# Altium schematic sheet Controller.SchDoc
size A4; SheetNumber: 2; SheetTotal: 2
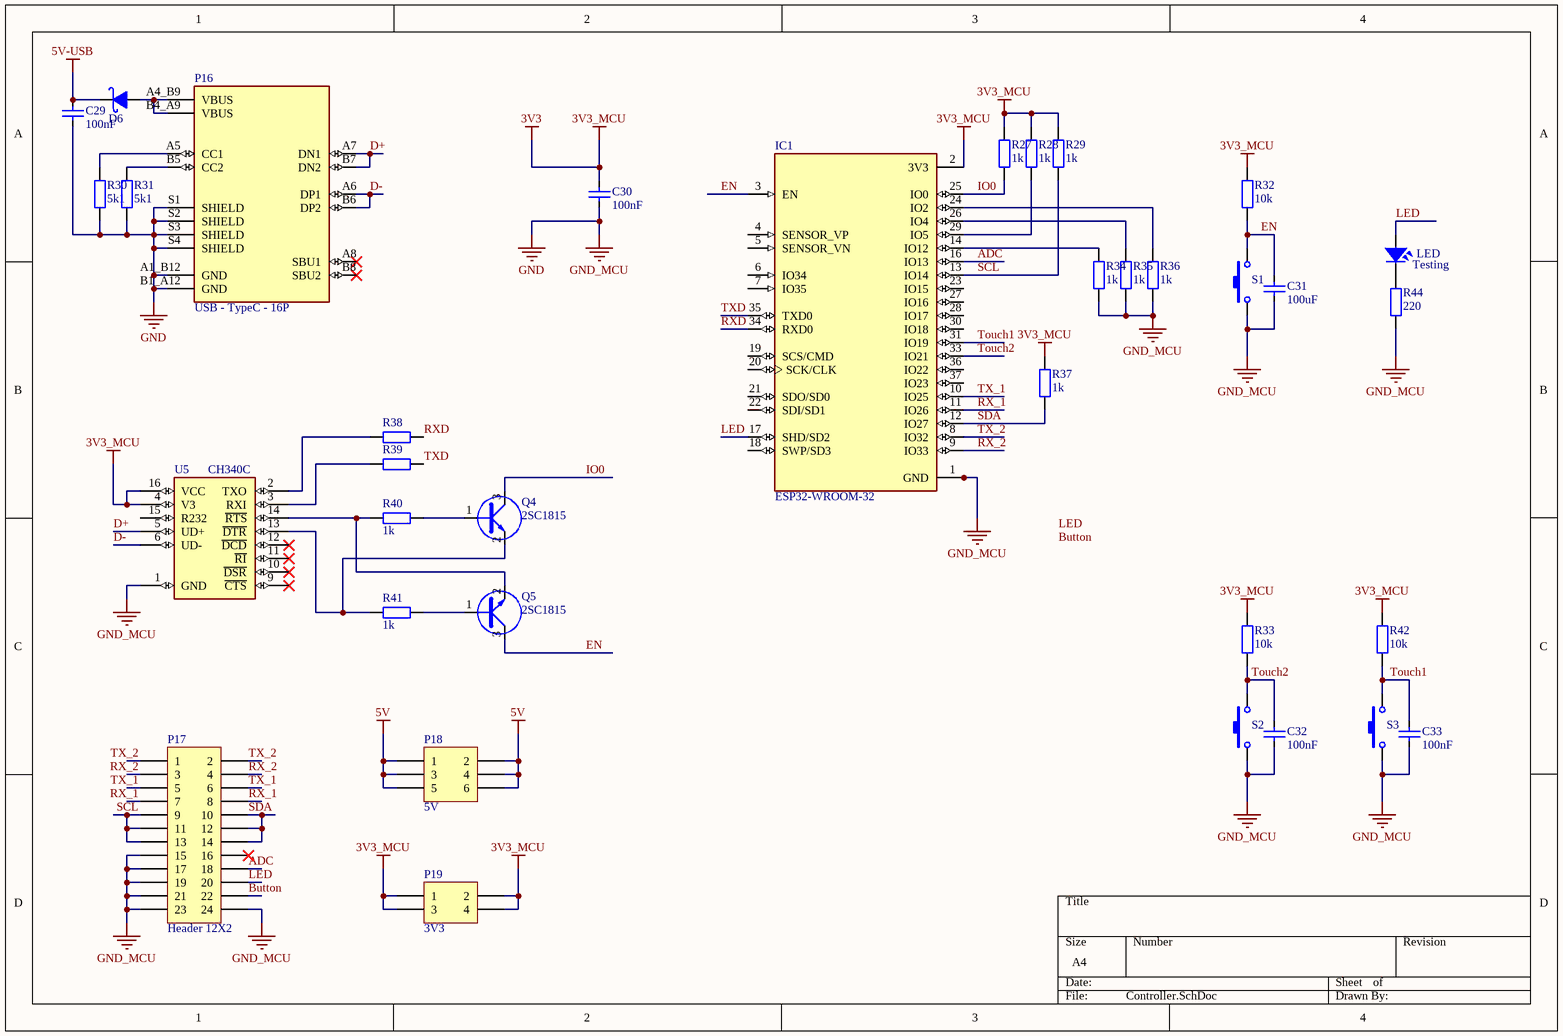
[diagram p0: Controller.SchDoc]

## Parts
C29  100nF  [CAP_0805]
C30  100nF  [CAP_0805]
C31  100uF  [CAP_0805]
C32  100nF  [CAP_0805]
C33  100nF  [CAP_0805]
D6  Diode Schottky  [DIO-214AA(SMB)]  (value not drawn)
IC1  ESP32-WROOM-32  [MODULE_ESP32-WROOM-32]
LED  Testing  [LED-0805-Blue]
P16  USB - TypeC - 16P  [USB C 16P]
P17  Header 12X2  [HDR2X12]  (no BOM)
P18  5V  [HDR2X3]  (no BOM)
P19  3V3  [HDR2X2]  (no BOM)
Q4  2SC1815  [SOT23D]
Q5  2SC1815  [SOT23D]
R27  1k  [RES-SMD-0805]
R28  1k  [RES-SMD-0805]
R29  1k  [RES-SMD-0805]
R30  5k1  [RES-SMD-0805]
R31  5k1  [RES-SMD-0805]
R32  10k  [RES-SMD-0805]
R33  10k  [RES-SMD-0805]
R34  1k  [RES-SMD-0805]
R35  1k  [RES-SMD-0805]
R36  1k  [RES-SMD-0805]
R37  1k  [RES-SMD-0805]
R38  0R  [RES-SMD-0805]  (value not drawn)
R39  0R  [RES-SMD-0805]  (value not drawn)
R40  1k  [RES-SMD-0805]
R41  1k  [RES-SMD-0805]
R42  10k  [RES-SMD-0805]
R44  220  [RES-SMD-0805]
S1  SW-SMD  [SW 3x2x4]  (value not drawn)
S2  SW-SMD  [SW 3x2x4]  (value not drawn)
S3  SW-SMD  [SW 3x2x4]  (value not drawn)
U5  CH340C  [SOP-16]

## Nets
3V3: C30.2 IC1.2(3V3) P19.1 P19.2 P19.3 P19.4 R27.1 R28.1 R29.1 R32.1 R33.1 R37.1 R42.1 U5.4(V3) U5.16(VCC)  [also labelled 3V3_MCU]
5V: P18.1 P18.2 P18.3 P18.4 P18.5 P18.6
5V-USB: C29.2 D6.2(K)
GND: C29.1 C30.1 C31.1 C32.1 C33.1 IC1.1(GND) IC1.15(GND) IC1.38(GND) IC1.39_1(GND) IC1.39_2(GND) IC1.39_3(GND) IC1.39_4(GND) IC1.39_5(GND) IC1.39_6(GND) IC1.39_7(GND) IC1.39_8(GND) IC1.39_9(GND) IC1.39_10(GND) IC1.39_11(GND) IC1.39_12(GND) IC1.39_13(GND) IC1.39_14(GND) IC1.39_15(GND) IC1.39_16(GND) IC1.39_17(GND) IC1.39_18(GND) IC1.39_19(GND) IC1.39_20(GND) IC1.39_21(GND) P16.A1_B12(GND) P16.B1_A12(GND) P16.S1(SHIELD) P16.S2(SHIELD) P16.S3(SHIELD) P16.S4(SHIELD) P17.15 P17.17 P17.19 P17.21 P17.23 P17.24 R30.2 R31.2 R34.2 R35.2 R36.1 R44.2 S1.1 S2.1 S3.1 U5.1(GND)  [also labelled GND_MCU]
ADC: IC1.16(IO13) P17.18
Button: P17.22
D+: P16.A7(DN1) P16.B7(DN2) U5.5(UD+)
D-: P16.A6(DP1) P16.B6(DP2) U5.6(UD-)
EN: C31.2 IC1.3(EN) Q5.3(C) R32.2 S1.2
IO0: IC1.25(IO0) Q4.3(C) R27.2
LED: IC1.17(SHD/SD2) LED.1 P17.20
RX_1: IC1.11(IO26) P17.7 P17.8
RX_2: IC1.9(IO33) P17.3 P17.4
RXD: IC1.34(RXD0) R38.1
SCL: IC1.13(IO14) P17.9 P17.11 P17.13 R29.2
SDA: IC1.12(IO27) P17.10 P17.12 P17.14 R37.2
Touch1: C33.2 IC1.31(IO19) R42.2 S3.2
Touch2: C32.2 IC1.33(IO21) R33.2 S2.2
TX_1: IC1.10(IO25) P17.5 P17.6
TX_2: IC1.8(IO32) P17.1 P17.2
TXD: IC1.35(TXD0) R39.1
NetD6_1: D6.1(A) P16.A4_B9(VBUS) P16.B4_A9(VBUS)
NetIC1_14: IC1.14(IO12) R34.1
NetIC1_24: IC1.24(IO2) R36.2
NetIC1_26: IC1.26(IO4) R35.1
NetIC1_29: IC1.29(IO5) R28.2
NetLED_2: LED.2 R44.1
NetP16_A5: P16.A5(CC1) R30.1
NetP16_B5: P16.B5(CC2) R31.1
NetQ4_1: Q4.1(B) R40.1
NetQ4_2: Q4.2(E) R41.2 U5.13(~{DTR})
NetQ5_1: Q5.1(B) R41.1
NetQ5_2: Q5.2(E) R40.2 U5.14(~{RTS})
NetR38_2: R38.2 U5.2(TXO)
NetR39_2: R39.2 U5.3(RXI)

Not connected (* = marked no-connect by the designer): IC1 4(SENSOR_VP) 5(SENSOR_VN) 6(IO34) 7(IO35) 18(SWP/SD3) 19(SCS/CMD) 20(SCK/CLK) 21(SDO/SD0) 22(SDI/SD1) 23(IO15) 27(IO16) 28(IO17) 30(IO18) 36(IO22) 37(IO23); P16 A8(SBU1)* B8(SBU2)*; P17 16*; U5 9(~{CTS})* 10(~{DSR})* 11(~{RI})* 12(~{DCD})* 15(R232)

## Notes on the sheet
- Labels drawn without touching a wire or pin: Button, LED

## Library data of the parts
C29-C33 = CapSMD: C 0805; Value: 33p; Published: 8-Jun-2000; LatestRevisionDate: 17-Jul-2002; LatestRevisionNote: Re-released for DXP Platform.; PackageReference: RAD-0.3; Publisher: Altium Limited
D6 = Diode Schottky: SS54
IC1 = ESP32-WROOM-32: Bluetooth, WiFi Transceiver Module 2.4GHz ~ 2.5GHz Surface Mount; MF: Espressif Systems; Package: Module Espressif Systems; Digi-Key_Part_Number: 1904-1010-1-ND; Digi-Key_Purchase_URL: https://www.digikey.com/product-detail/en/espressif-systems/ESP32-WROOM-32/1904-1010-1-ND/8544305?utm_source=snapeda&utm_medium=aggregator&utm_campaign=symbol; Value: *; MP: ESP32-WROOM-32; SnapEDA_Link: https://www.snapeda.com/parts/ESP32-WROOM-32/Espressif%20Systems/view-part/2753322/?ref=snap
LED = LED: LED Single colour Green and Red; Value: LED 3 ly Single Colour
P17 = Header 12X2: Header, 12-Pin, Dual row; LatestRevisionDate: 17-Jul-2002; LatestRevisionNote: Re-released for DXP Platform.; Publisher: Altium Limited
P18 = Header 3X2: Header, 3-Pin, Dual row; LatestRevisionDate: 17-Jul-2002; LatestRevisionNote: Re-released for DXP Platform.; Publisher: Altium Limited
P19 = Header 2X2: Header, 2-Pin, Dual row; LatestRevisionDate: 17-Jul-2002; LatestRevisionNote: Re-released for DXP Platform.; Publisher: Altium Limited
Q4 Q5 = C1815: NPN 600mW, ECB; Value: C1815
R27-R42 R44 = Resistor - SMD: R 0805; Manufacturer: Generic Components; Class: Passive; Published: 08/06/2000; Publisher: Altium Hobart Technology Centre
S1-S3 = SW-SMD: Switch; Published: 24-Mar-1999; LatestRevisionDate: 17-Jul-2002; LatestRevisionNote: Re-released for DXP Platform.; PackageReference: SPST-2; Publisher: Altium Limited
U5 = CH340C: USB to serial chip CH340; MF: WCH; Package: Package; Check_prices: https://www.snapeda.com/parts/CH340C/WCH/view-part/5428851/?ref=eda; Value: *; Price: None; MP: CH340C; Availability: Unavailable; SnapEDA_Link: https://www.snapeda.com/parts/CH340C/WCH/view-part/5428851/?ref=snap
P16 = USB - TypeC - 16P: ComponentLink1Description: New link; ComponentLink1URL: https://linhkien.cxtvn.com/6914-cong-type-c-cai-16p-usb-31-v2.html